# Altium schematic sheet logi-cmos-7725-7670-NoFFC.SchDoc: PMOD Camera Adapter
size A; Engineer: Michael Jones; Revision: RA.1; ProjectName: OV7725
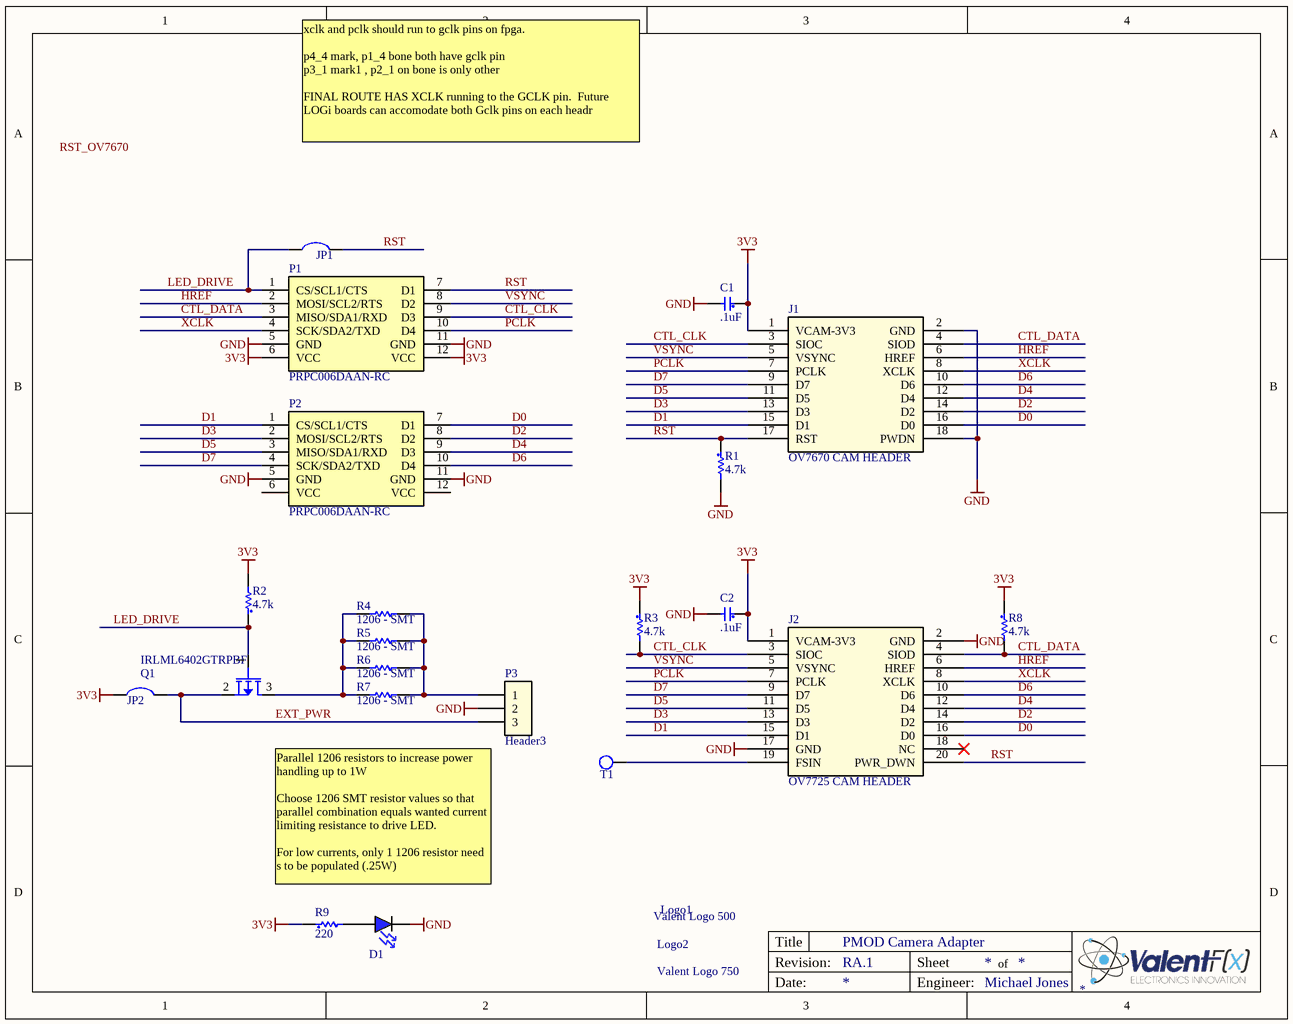
[diagram p0: logi-cmos-7725-7670-NoFFC.SchDoc]

## Parts
C1  .1uF  [C0603]
C2  .1uF  [C0603]
D1  BLUE LED0603  [LED_0603 - BLUE]  (value not drawn)
J1  OV7670 CAM HEADER  [HEADER_9x2_40_100 1-3-5 THRU DIP]
J2  OV7725 CAM HEADER  [HEADER_10x2_40_100 1-3-5 THRU DIP]
JP1  Solder Jumper  [SOLDER_JUMPER]  (value not drawn)  (no BOM)
JP2  Solder Jumper  [SOLDER_JUMPER]  (value not drawn)  (no BOM)
Logo1  Valent Logo 500  [VALENTFX_500-SolderMask]
Logo2  Valent Logo 750  [VALENTFX_750-SolderMask-BOT]
P1  PRPC006DAAN-RC  [PMOD HEADER - Male]
P2  PRPC006DAAN-RC  [PMOD HEADER - Male]
P3  Header3  [HEADER_3_40_100 THRU SIP]
Q1  IRLML6402GTRPBF  [SOT-23]
R1  4.7k  [R0603]
R2  4.7k  [R0603]
R3  4.7k  [R0603]
R4  1206 - SMT  [R1206]
R5  1206 - SMT  [R1206]
R6  1206 - SMT  [R1206]
R7  1206 - SMT  [R1206]
R8  4.7k  [R0603]
R9  220  [R0603]
T1  Test Point  [Tp 25-40]  (value not drawn)

## Nets
3V3: C1.1 C2.1 J1.1(VCAM-3V3) J2.1(VCAM-3V3) JP2.1 P1.6(VCC) P1.12(VCC) R2.2 R3.1 R8.1 R9.1
GND: C1.2 C2.2 D1.C J1.2(GND) J1.18(PWDN) J2.2(GND) J2.17(GND) P1.5(GND) P1.11(GND) P2.5(GND) P2.11(GND) P3.2 R1.2
CTL_CLK: J1.3(SIOC) J2.3(SIOC) P1.9(D3) R3.2
CTL_DATA: J1.4(SIOD) J2.4(SIOD) P1.3(MISO/SDA1/RXD) R8.2
D0: J1.16(D0) J2.16(D0) P2.7(D1)
D1: J1.15(D1) J2.15(D1) P2.1(CS/SCL1/CTS)
D2: J1.14(D2) J2.14(D2) P2.8(D2)
D3: J1.13(D3) J2.13(D3) P2.2(MOSI/SCL2/RTS)
D4: J1.12(D4) J2.12(D4) P2.9(D3)
D5: J1.11(D5) J2.11(D5) P2.3(MISO/SDA1/RXD)
D6: J1.10(D6) J2.10(D6) P2.10(D4)
D7: J1.9(D7) J2.9(D7) P2.4(SCK/SDA2/TXD)
EXT_PWR: JP2.2 P3.3 Q1.2(S)
HREF: J1.6(HREF) J2.6(HREF) P1.2(MOSI/SCL2/RTS)
LED_DRIVE: JP1.1 P1.1(CS/SCL1/CTS) Q1.1(G) R2.1
PCLK: J1.7(PCLK) J2.7(PCLK) P1.10(D4)
RST: J1.17(RST) J2.20(PWR_DWN) JP1.2 P1.7(D1) R1.1
VSYNC: J1.5(VSYNC) J2.5(VSYNC) P1.8(D2)
XCLK: J1.8(XCLK) J2.8(XCLK) P1.4(SCK/SDA2/TXD)
NetD1_A: D1.A R9.2
NetJ2_19: J2.19(FSIN) T1.1
NetP3_1: P3.1 R4.2 R5.2 R6.2 R7.2
NetQ1_3: Q1.3(D) R4.1 R5.1 R6.1 R7.1

Not connected (* = marked no-connect by the designer): J2 18(NC)*; P2 6(VCC) 12(VCC)

## Notes on the sheet
- xclk and pclk should run to gclk pins on fpga.
  p4_4 mark, p1_4 bone both have gclk pin
  p3_1 mark1 , p2_1 on bone is only other
  FINAL ROUTE HAS XCLK running to the GCLK pin.  Future LOGi boards can accomodate both Gclk pins on each headr
- Parallel 1206 resistors to increase power handling up to 1W
  Choose 1206 SMT resistor values so that parallel combination equals wanted current limiting resistance to drive LED.
  For low currents, only 1 1206 resistor need s to be populated (.25W)
- Labels drawn without touching a wire or pin: RST_OV7670
- Title
- Revision:
- Sheet
- of
- Date:
- Engineer:

## Library data of the parts
C1 C2 = C0603 - C1608X7R1E104MT: .10uF X7R 20% (MLCC) - SMD/SMT 0603 25volts; Manufacturer: TDK; Capacitance: 0.1 uF; Supplier 1: Mouser; Manufacturer Part Number: C1608X7R1E104MT; RoHS: RoHS Compliant By Exemption; Category: Multilayer Ceramic Capacitors (MLCC) - SMD/SMT; Stock 1: 69148; Pricing 1: 1=0.365, 50=0.149, 100=0.085, 500=0.045, 1000=0.030, 4000=0.027, 8000=0.023, 12000=0.019, 20000=0.018 (AUD); Dimensions: 0.8 mm W x 1.6 mm L; Operating Temperature Range: - 55 C to + 125 C; Package / Case: 0603 (1608 metric); Packaging: Reel; Product: General Type MLCCs; Termination Style: SMD/SMT; Tolerance: 20 %; Voltage Rating: 25 Volts; Product Category: Low & Medium Capacitance SMD Ceramic Chip Capacitors; Standard Pack Qty: 4000.0; Temperature Coefficient / Code: X7R; RoHS - Mouser: E; Minimum Order Quantity: 1; Reeling: True; ComponentLink1URL: http://www.tdk.co.jp/tefe02/e411_c.pdf; ComponentLink1Description: http://www.tdk.co.jp/tefe02/e411_c.pdf; Supplier Part Number 1: 810-C1608X7R1E104M; Value: .1uF
D1 = LED0603 - HT-193NB-5589: BLUE Standard LED - SMD Blue 470nm 40mcd 20mA; Manufacturer: Harvatek International; LED Size: 0603; Lens Shape: Rectangular; Luminous Intensity: 45 mcd; Supplier 1: Mouser; Manufacturer Part Number: HT-193NB-5589; RoHS: RoHS Compliant; Category: Standard LED - SMD; Stock 1: 108922; Pricing 1: 1=0.203, 10=0.176, 50=0.135, 100=0.117, 500=0.101, 1000=0.085, 2000=0.068, 4000=0.068, 5000=0.059, 10000=0.051 (AUD); Illumination Color: Blue; Package / Case: 0603; Packaging: Reel; Wavelength: 470 nm; Lens Dimensions: 1 mm x 0.8 mm; Maximum Operating Temperature: + 80 C; Minimum Operating Temperature: - 30 C; Product Category: Surface Mount LEDs; RoHS - Mouser: Y; Minimum Order Quantity: 1; Reeling: True; ComponentLink1URL: http://harvatekchina.com/specification/HT-193NB.pdf; ComponentLink1Description: http://harvatekchina.com/specification/HT-193NB.pdf; Supplier Part Number 1: 743-HT-193NB-5589; Value: BLUE LED0603
J1 = CAM - OV7670: CMOS CAMERA HEADER; Manufacturer: Sullins Connector Solutions; Manufacturer Part Number: PPPC092LFBN-RC; Number of Positions: 18; Number of Positions Loaded: All; Pitch: 0.100" (2.54mm); Value: PPPC092LFBN-RC; Supplier 1: Digi-Key; RoHS: RoHS Compliant; Category: Connectors, Interconnects; Stock 1: 3381; Pricing 1: 1=1.38, 10=1.145, 25=1.06, 50=0.954, 100=0.848, 250=0.742, 500=0.6784, 1000=0.6148, 2500=0.5512 (USD); Packaging: Bulk; Connector Type: Header; Contact Type: Female Socket; Number of Rows: 2; Row Spacing: 0.100" (2.54mm); Mounting Type: Through Hole; Termination: Solder; Fastening Type: -; Features: -; Contact Finish: Gold; Contact Finish Thickness: Flash; Color: Black; ComponentLink1URL: http://www.sullinscorp.com/drawings/78_P(N)PxCxxxLFBN-RC,_10492-G.pdf; ComponentLink1Description: http://www.sullinscorp.com/drawings/78_P(N)PxCxxxLFBN-RC,_10492-G.pdf; Supplier Part Number 1: S7112-ND
J2 = CAM - 0V7725: CMOS CAMERA HEADER; Manufacturer: Sullins Connector Solutions; Manufacturer Part Number: SFH11-PBPC-D10-ST-BK; Number of Positions: 20; Number of Positions Loaded: All; Pitch: 0.100" (2.54mm); Value: SFH11-PBPC-D10-ST-BK; Supplier 1: Digi-Key; RoHS: RoHS Compliant; Category: Connectors, Interconnects; Stock 1: 2705; Pricing 1: 1=1.35, 10=1.121, 50=0.9338, 100=0.83, 250=0.72624, 500=0.664, 1000=0.60175, 2500=0.5395, 5000=0.52913 (USD); Packaging: Tray; Connector Type: Header; Contact Type: Female Socket; Number of Rows: 2; Row Spacing: 0.100" (2.54mm); Mounting Type: Through Hole; Termination: Solder; Fastening Type: -; Features: Polarizing Key; Contact Finish: Gold; Contact Finish Thickness: Flash; Color: Black; ComponentLink1URL: http://media.digikey.com/pdf/Data%20Sheets/Sullins%20PDFs/SFH11-PxxC-Dxx-ST-xx%2011160-C.pdf; ComponentLink1Description: http://media.digikey.com/pdf/Data%20Sheets/Sullins%20PDFs/SFH11-PxxC-Dxx-ST-xx%2011160-C.pdf; Supplier Part Number 1: S9197-ND
JP1 JP2 = Solder Jumper: Solder/Configuration Jumper; Manufacturer: n/a; Manufacturer Part Number: n/a; Source: n/a; Source Part Number: n/a; ROHS Certificate: n/a
P1 P2 = P-MOD - MTSW-106-07-G-D-130-RA: Manufacturer: Samtec; Lead Time: 0 weeks; Peak Solder Temperature: 260 deg C; MSL (Moisture Sensitivity Level): N/R; Supplier 1: Arrow; Manufacturer Part Number: MTSW-106-07-G-D-130-RA; RoHS: CHINA ROHS: Compliant / EU ROHS: Compliant; Stock 1: 0; Termination Finish: Au/Ni; China ROHS Lead (X -> above / O -> below threshold): O; China ROHS Mercury (X -> above / O -> below threshold): O; China ROHS Cadmium (X -> above / O -> below threshold): O; China ROHS Hex Chromium (X -> above / O -> below threshold): O; China ROHS PBB (X -> above / O -> below threshold): O; China ROHS PBDE (X -> above / O -> below threshold): O; EU_ROHS_PROD_EXEMPTION_BY_SUPP: N/R; ComponentLink1URL: http://components.arrow.com/partservice/dataview/altium/2717179?apiKey=aa438727d59eed98c4bed826d8d949c84cb5e685b92bf87346a0226bd2658797; ComponentLink1Description: http://components.arrow.com/partservice/dataview/altium/2717179?apiKey=aa438727d59eed98c4bed826d8d949c84cb5e685b92bf87346a0226bd2658797; Supplier Part Number 1: 2717179; =Value: MTSW-106-07-G-D-130-RA; Value: PRPC006DAAN-RC
P3 = Header3: Header  pin
Q1 = PMOS - IRLML6402GTRPBF: MOSFET P-CH 20V 3.7A SOT-23-3; Manufacturer: International Rectifier; FET Type: MOSFET P-Channel, Metal Oxide; FET Feature: Logic Level Gate; Rds On (Max) @ Id, Vgs: 65 mOhm @ 3.7A, 4.5V; Vgs(th) (Max) @ Id: 1.2V @ 250µA; Gate Charge (Qg) @ Vgs: 12nC @ 5V; Input Capacitance (Ciss) @ Vds: 633pF @ 10V; Power - Max: 1.3W; Supplier 1: Digi-Key; Manufacturer Part Number: IRLML6402GTRPBF; RoHS: RoHS Compliant; Category: Discrete Semiconductor Products; Stock 1: 8348; Pricing 1: 1=0.67, 10=0.381, 25=0.328, 50=0.2762, 100=0.2471, 250=0.22456, 500=0.20204, 1000=0.18912 (USD); Drain to Source Voltage (Vdss): 20V; Current - Continuous Drain (Id) @ 25° C: 3.7A; Mounting Type: Surface Mount; Package / Case: TO-236-3, SC-59, SOT-23-3; Supplier Device Package: Micro3™/SOT-23; Packaging: Cut Tape (CT); ComponentLink1URL: http://www.irf.com/product-info/datasheets/data/irlml6402gpbf.pdf; ComponentLink1Description: http://www.irf.com/product-info/datasheets/data/irlml6402gpbf.pdf; Supplier Part Number 1: IRLML6402GTRPBFCT-ND; VALUE: IRLML6402GTRPBF
R1-R3 R8 = R0603 - CRCW06034K70FKEA: 4.7k Thick Film Resistors - SMD 1/10watt 4.7Kohms 1%; Manufacturer: Vishay Dale; Power (Watts): 0.1W, 1/10W; Temperature Coefficient: ±100ppm/°C; Supplier 1: Digi-Key; Manufacturer Part Number: CRCW06034K70FKEA; RoHS: RoHS Compliant; Category: Resistors; Stock 1: 51919; Pricing 1: 10=0.081, 50=0.0436, 200=0.0251, 1000=0.01711 (USD); Resistance (Ohms): 4.7K; Composition: Thick Film; Features: -; Tolerance: ±1%; Package / Case: 0603 (1608 Metric); Size / Dimension: 0.061" L x 0.033" W (1.55mm x 0.85mm); Height: 0.020" (0.50mm); Number of Terminations: 2; Packaging: Cut Tape (CT); ComponentLink1URL: http://www.vishay.com/doc?20035; ComponentLink1Description: http://www.vishay.com/doc?20035; Supplier Part Number 1: 541-4.70KHCT-ND; Value: 4.7k
R4-R7 = ERJ-8GEYJ271V: RES 270 OHM 1/4W 5% 1206 SMD; Manufacturer: Panasonic - ECG; Value: 270; Power (Watts): 0.25W, 1/4W; Temperature Coefficient: ±200ppm/°C; Supplier 1: Digi-Key; Manufacturer Part Number: ERJ-8GEYJ271V; RoHS: RoHS Compliant; Category: Resistors; Stock 1: 396984; Pricing 1: 1=0.06, 50=0.0242, 100=0.0184, 250=0.01364, 500=0.01008, 1000=0.00672 (USD); Resistance (Ohms): 270; Composition: Thick Film; Features: -; Tolerance: ±5%; Size / Dimension: 0.126" L x 0.063" W (3.20mm x 1.60mm); Height: 0.024" (0.60mm); Number of Terminations: 2; Packaging: Cut Tape (CT); Package / Case: 1206 (3216 Metric); ComponentLink1URL: http://industrial.panasonic.com/www-cgi/jvcr13pz.cgi?E+PZ+3+AOA0001+ERJ8GEYJ271V+7+WW; ComponentLink1Description: http://industrial.panasonic.com/www-cgi/jvcr13pz.cgi?E+PZ+3+AOA0001+ERJ8GEYJ271V+7+WW; Supplier Part Number 1: P270ECT-ND
R9 = R0603 - ERJ-3EKF2200V: 220 - thick Film Resistors - SMD 0603 220ohms 1% Tol; Manufacturer: Panasonic - ECG; Power (Watts): 0.1W, 1/10W; Temperature Coefficient: ±100ppm/°C; Supplier 1: Digi-Key; Manufacturer Part Number: ERJ-3EKF2200V; RoHS: RoHS Compliant; Category: Resistors; Stock 1: 517798; Pricing 1: 1=0.1, 50=0.0138, 100=0.0105, 250=0.0078, 500=0.00576, 1000=0.00384 (USD); Resistance (Ohms): 220; Composition: Thick Film; Features: -; Tolerance: ±1%; Package / Case: 0603 (1608 Metric); Size / Dimension: 0.063" L x 0.031" W (1.60mm x 0.80mm); Height: 0.022" (0.55mm); Number of Terminations: 2; Packaging: Cut Tape (CT); ComponentLink1URL: http://industrial.panasonic.com/www-cgi/jvcr13pz.cgi?E+PZ+3+AOA0002+ERJ3EKF2200V+7+WW; ComponentLink1Description: http://industrial.panasonic.com/www-cgi/jvcr13pz.cgi?E+PZ+3+AOA0002+ERJ3EKF2200V+7+WW; Supplier Part Number 1: P220HCT-ND; Value: 220
T1 = Test Point 2: Test Point Smaller Symbol